# EAGLE design BLEbee-1_0_0 (EAGLE 6.4)
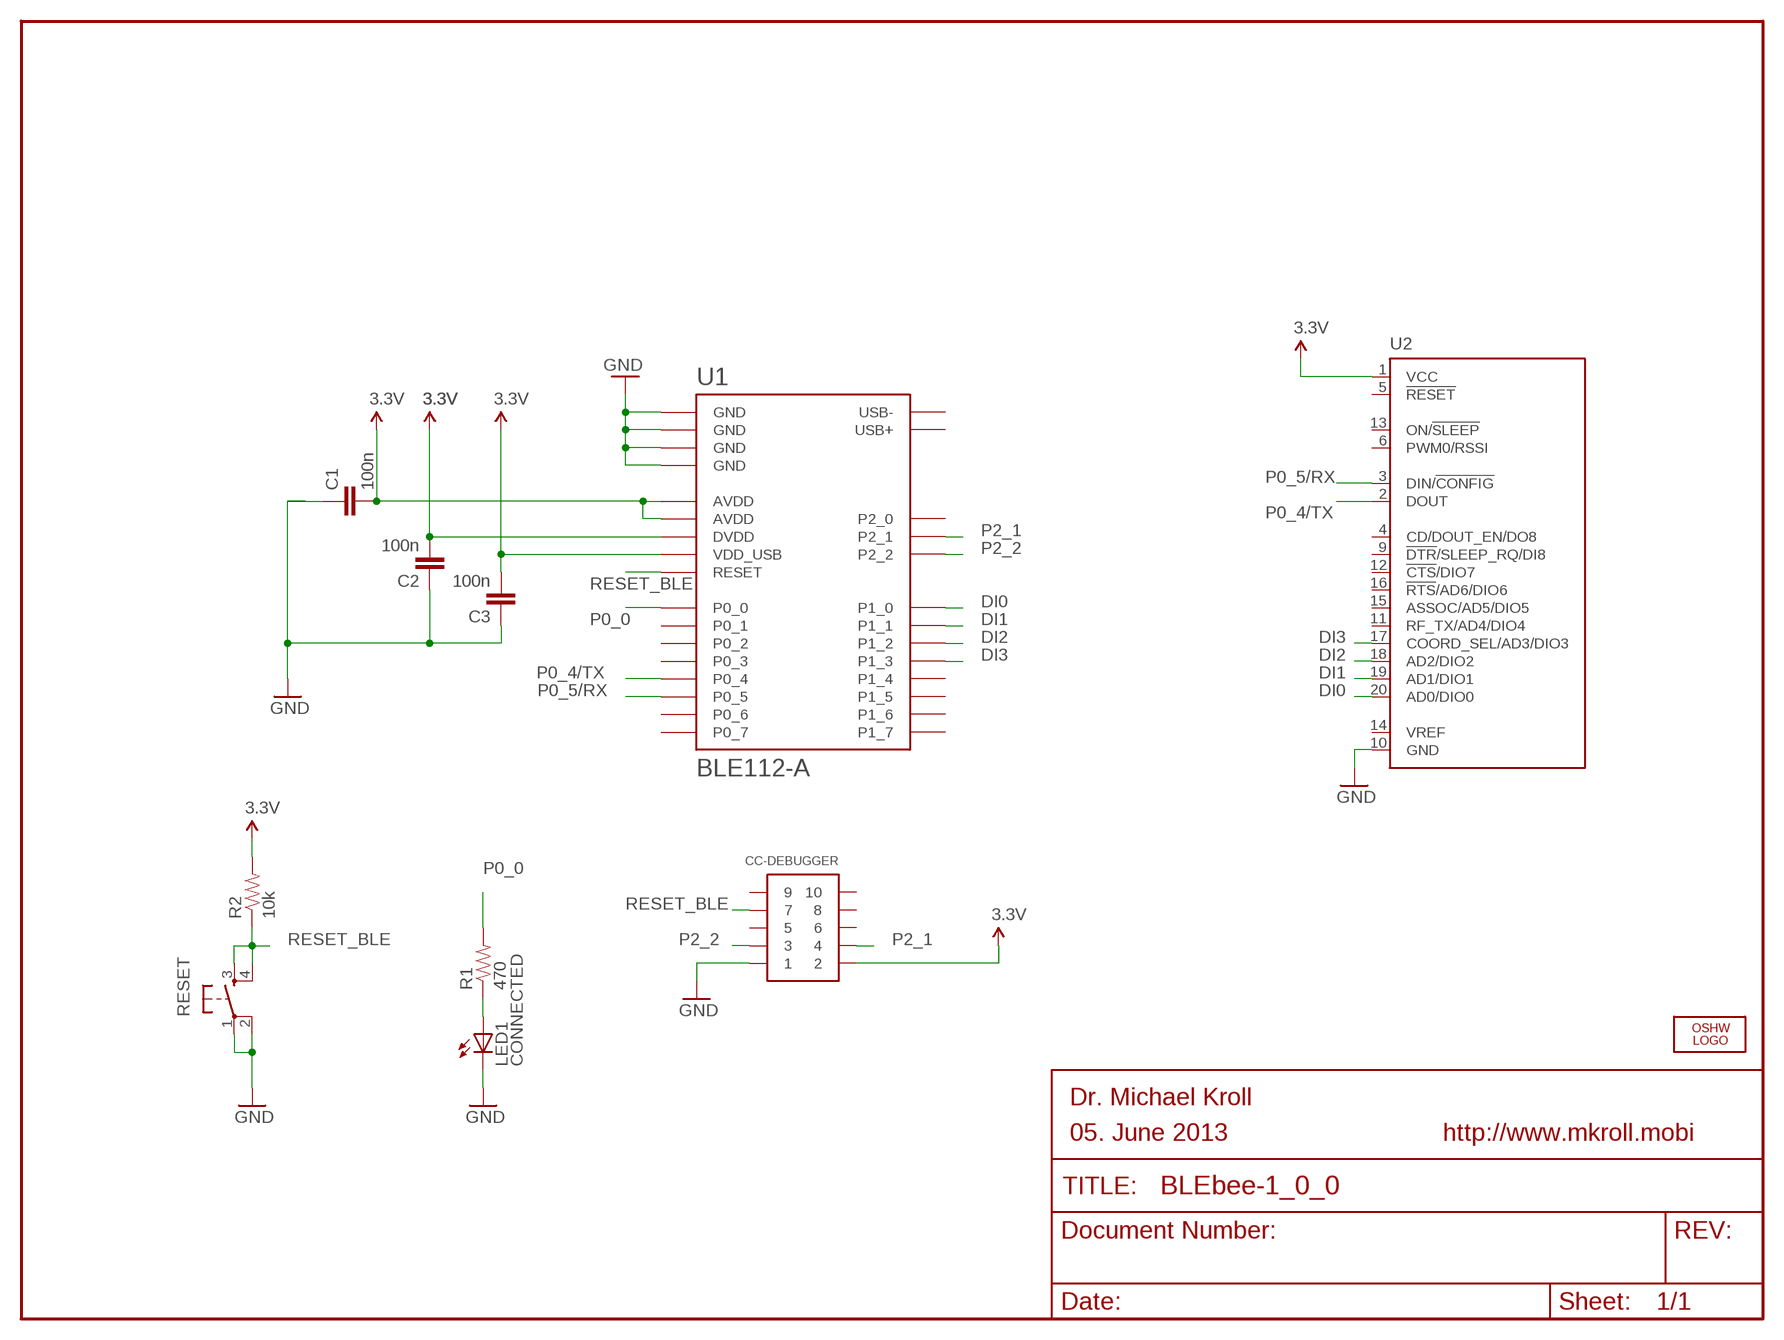
[diagram p0: schematic, sheet 1]

## Parts
C1  100n  CAP0402-CAP  [0402-CAP]
C2  100n  CAP0402-CAP  [0402-CAP]
C3  100n  CAP0402-CAP  [0402-CAP]
CC-DEBUGGER  CONN_5-2-FTSH-V  [FTSH-105-DV]
LED1  CONNECTED  LED0603  [LED-0603]
LOGO1  LOGO-OSHW-6MILX0100-NT  [OSHW_6X100_NOTEXT]
R1  470  RESISTOR0402-RES  [0402-RES]
R2  10k  RESISTOR0402-RES  [0402-RES]
RESET  TAC_SWITCHSMD  [TACTILE_SWITCH_SMD]
U1  BLE112-A  [BLE112-A]
U2  BEE-XBEE-DIP  [20P-DIP-2.0-W/-SILK]

## Nets
3.3V: C1.2 C2.2 C3.2 CC-DEBUGGER.2 R2.2 U1.AVDD1(AVDD) U1.AVDD2(AVDD) U1.DVDD U1.VDD_USB U2.1(VCC)
DI0: U1.P1_0 U2.20(AD0/DIO0)
DI1: U1.P1_1 U2.19(AD1/DIO1)
DI2: U1.P1_2 U2.18(AD2/DIO2)
DI3: U1.P1_3 U2.17(COORD_SEL/AD3/DIO3)
GND: C1.1 C2.1 C3.1 CC-DEBUGGER.1 LED1.C RESET.1 RESET.2 U1.GND1(GND) U1.GND2(GND) U1.GND3(GND) U1.GND4(GND) U2.10(GND)
N$1: LED1.A R1.1
P0_0: R1.2 U1.P0_0
P0_4/TX: U1.P0_4 U2.2(DOUT)
P0_5/RX: U1.P0_5 U2.3(DIN/!CONFIG)
P2_1: CC-DEBUGGER.4 U1.P2_1
P2_2: CC-DEBUGGER.3 U1.P2_2
RESET_BLE: CC-DEBUGGER.7 R2.1 RESET.3 RESET.4 U1.RESET
Unconnected: CC-DEBUGGER.5 CC-DEBUGGER.6 CC-DEBUGGER.8 CC-DEBUGGER.9 CC-DEBUGGER.10 U1.P0_1 U1.P0_2 U1.P0_3 U1.P0_6 U1.P0_7 U1.P1_4 U1.P1_5 U1.P1_6 U1.P1_7 U1.P2_0 U1.USB+ U1.USB- U2.4(CD/DOUT_EN/DO8) U2.5(!RESET) U2.6(PWM0/RSSI) U2.9(!DTR!/SLEEP_RQ/DI8) U2.11(RF_TX/AD4/DIO4) U2.12(!CTS!/DIO7) U2.13(ON/!SLEEP) U2.14(VREF) U2.15(ASSOC/AD5/DIO5) U2.16(!RTS!/AD6/DIO6)

## Notes on the sheet
- Dr. Michael Kroll
- 05. June 2013 | http://www.mkroll.mobi

## Library data of the parts
C1-C3 = SparkFun-Capacitors:CAP: Capacitor Standard 0603 ceramic capacitor, and 0.1" leaded capacitor.
CC-DEBUGGER = pel_misc:CONN_5-2
LED1 = SparkFun-LED:LED: LEDs Standard schematic elements and footprints for 5mm, 3mm, 1206, and 0603 sized LEDs. 5mm - Spark Fun Electronics SKU : COM-00529 (and others)
LOGO1 = Logo:LOGO-OSHW-6MIL
R1 R2 = SparkFun-Resistors:RESISTOR: Resistor Basic schematic elements and footprints for 0603, 1206, and PTH resistors.
RESET = SparkFun-Electromechanical:TAC_SWITCH: Momentary Switch Button commonly used for reset or general input. Spark Fun Electronics SKU : COM-00097 SMT- SWCH-08247; PROD_ID: SWCH-08247
U1 = sf-bluegiga:BLE112-A: Bluetooth Low Energy single-mode module - Bluetooth 4.0, chip antenna
U2 = Module:BEE-XBEE: XBee (TM) /XBee-PRO(TM) OEM RF Modules Source: MaxStream, Inc. xbee_productmanual.pdf

## Board
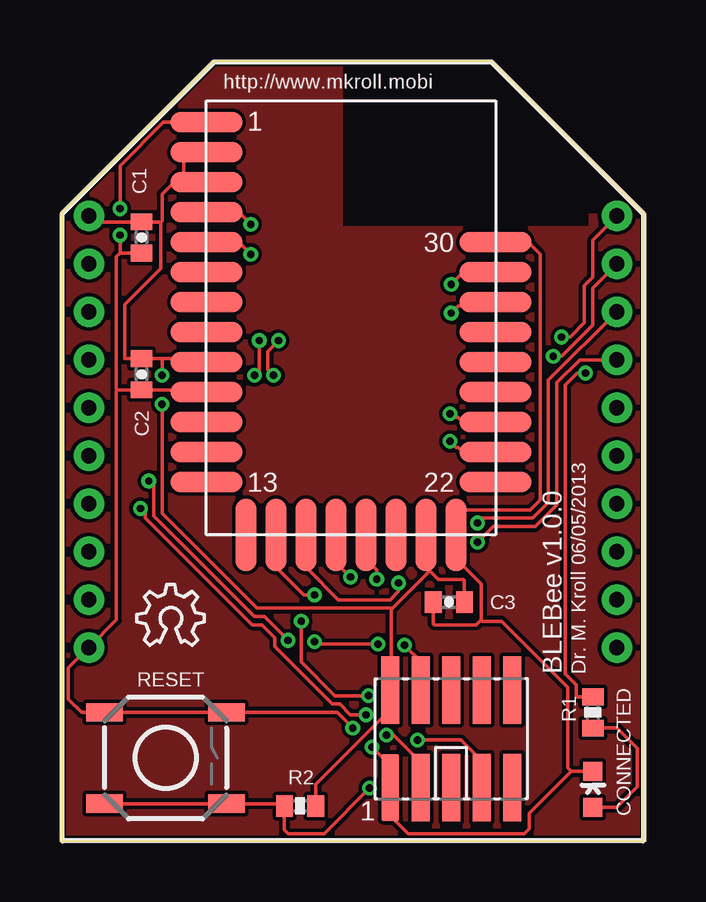
[diagram p1: board, top side]
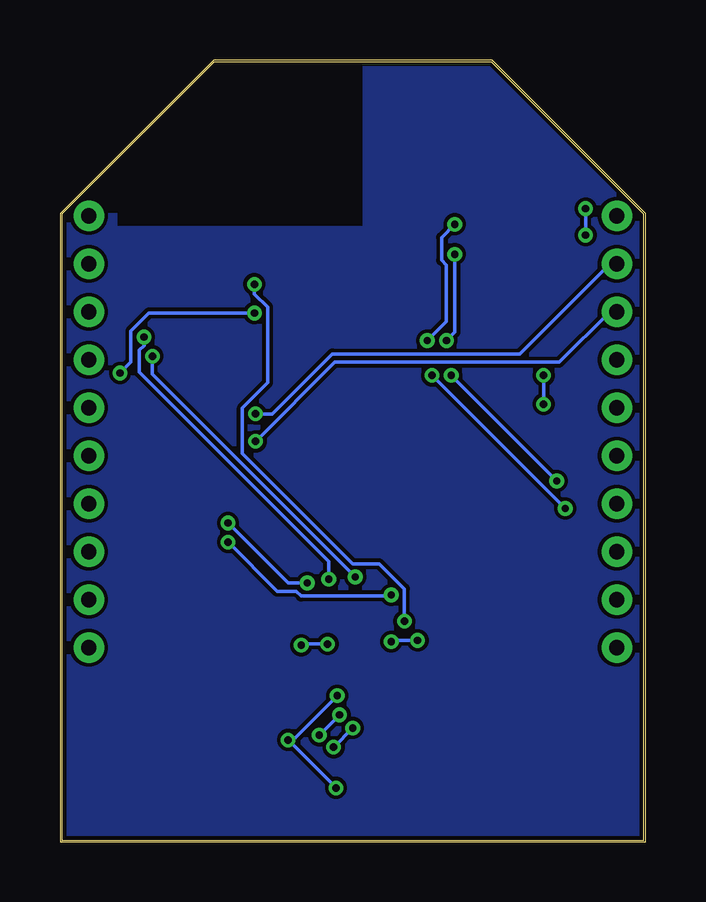
[diagram p2: board, bottom side, seen from below]

Size 24.4 x 32.6 mm. Coordinates in mm from the lower left corner, seen from the top.
Outline: 0,26.2 6.4,32.6 18,32.6 24.4,26.2 24.4,0 0,0 0,26.2
Copper layers (1*2*15*16): Top 0.035mm / dielectric 0.2mm / layer 2 0.0175mm / dielectric 1.1mm / layer 15 0.0175mm / dielectric 0.2mm / Bottom 0.035mm
Design rules "SeeedStudio_DRU_no_angle_20130527": minimum track width 6mil, minimum drill 12mil, track to track 6mil, track to pad 6mil, pad to pad 6mil, via to via 6mil, smd to smd 0mil, copper to edge 10mil, drill to drill 10mil, minimum pad ring 6mil, minimum via ring 6mil, stop-mask expansion 2mil, vias tented up to drill 25mil, thermal gap 10mil
tRestrict: area 11.8,25.7 to 22,32.6
bRestrict: area 11.8,25.7 to 22,32.6

### Footprints (pad centres in the part's own frame; a part is rotated, then mirrored left to right if it is on the bottom)
0402-CAP = smd 0.7 x 0.9: 1 -0.65,0; 2 0.65,0
FTSH-105-DV = smd 0.74 x 2.8: 1 -2.54,-2.03; 2 -2.54,2.03; 3 -1.27,-2.03; 4 -1.27,2.03; 5 0,-2.03; 6 0,2.03; 7 1.27,-2.03; 8 1.27,2.03; 9 2.54,-2.03; 10 2.54,2.03
LED-0603 = smd 0.8 x 0.8: A 0,-0.75; C 0,0.75
0402-RES = smd 0.7 x 0.9: 1 -0.65,0; 2 0.65,0
TACTILE_SWITCH_SMD = smd 1.524 x 0.762: 1 -2.54,1.905; 2 2.54,1.905; 3 -2.54,-1.905; 4 2.54,-1.905
BLE112-A = smd 3 x 0.85: AVDD1 -6.05,6.9; AVDD2 -6.05,5.65; GND1 -6.05,8.15; GND2 -6.05,-3.1; GND4 6,3.15; P0_0 6,0.65; P0_1 6,-0.6; P0_2 6,-1.85; P0_3 6,-3.1; P0_4 6,-4.35; P0_5 6,-5.6; P0_6 6,-6.85; P1_5 -6.05,-6.85; P1_6 -6.05,-0.6; P1_7 -6.05,0.65; P2_0 -6.05,1.9; P2_1 -6.05,3.15; P2_2 -6.05,4.4; RESET 6,1.9; USB+ -6.05,-4.35; USB- -6.05,-5.6; VDD_USB -6.05,-1.85 | smd 0.85 x 3: DVDD 3.1,-9.05; GND3 4.35,-9.05; P0_7 1.85,-9.05; P1_0 0.6,-9.05; P1_1 -0.65,-9.05; P1_2 -1.9,-9.05; P1_3 -3.15,-9.05; P1_4 -4.4,-9.05
20P-DIP-2.0-W/-SILK = drill 0.635 pad 1.27: 1 -11,9; 2 -11,7; 3 -11,5; 4 -11,3; 5 -11,1; 6 -11,-1; 7 -11,-3; 8 -11,-5; 9 -11,-7; 10 -11,-9; 11 11,-9; 12 11,-7; 13 11,-5; 14 11,-3; 15 11,-1; 16 11,1; 17 11,3; 18 11,5; 19 11,7; 20 11,9

### Placement (x,y rotation side)
C1  3.4,25.2 90 top
C2  3.4,19.5 90 top
C3  16.2,10 0 top
CC-DEBUGGER  16.3,4.3 0 top
LED1  22.2,2.2 0 top
LOGO1  3.2,8.2 0 top
R1  22.2,5.4 90 top
R2  10,1.5 0 top
RESET  4.4,3.5 0 top
U1  12.15,21.85 0 top
U2  12.2,17.1 0 top

### Tracks (layer width: path | path; a pad name or v marks a point on that pad's centre or on a via)
3.3V  (via drill 0.3)
  Top 0.152: C3.2 16.85,10.9 16.8,10.95 15.75,10.95 15.4,11.3 | 15.4,11.3 15.3,11.4 15.3,11.75 15.25,11.8 U1.DVDD | R2.2 10.65,2.4 13.55,5.3 13.7,5.3 13.75,5.35 13.75,6.3 CC-DEBUGGER.2 13.75,6.4 13.75,7.3 13.8,7.35 13.8,9.7 | 13.8,9.7 15.4,11.3 | 4.25,20.15 4.95,20.15 5.1,20 U1.VDD_USB | 4.25,20.15 C2.2 2.7,20.15 2.7,22.4 4.2,23.9 4.2,25.85 | U2.1 1.45,25.85 C1.2 4.2,25.85 | 4.2,25.85 4.25,25.9 4.25,27 4.7,27.45 5.05,27.45 5.1,27.5 U1.AVDD2 5.15,27.55 5.15,28.7 5.2,28.75 U1.AVDD1 | v4.25,18.25 4.25,13.7 8.2,9.75 13.75,9.75 13.8,9.7 | 4.25,20.15 v4.25,19.45
  Bottom 0.152: v4.25,19.45 v4.25,18.25
DI0  (via drill 0.3)
  Top 0.152: U2.20 22.2,25.1 22.2,23.55 21.85,23.2 21.85,21.65 21.25,21.05 v20.9,21.05 | v13.2,10.95 13.2,11.35 12.75,11.8 U1.P1_0
  Bottom 0.152: v20.9,21.05 20.9,20.7 21.1,20.5 21.1,19.6 13.2,11.7 v13.2,10.95
DI1  (via drill 0.3)
  Top 0.152: U2.19 22.2,23.1 22.2,21.55 20.9,20.25 v20.55,20.25 | v12.1,11.05 11.55,11.6 11.55,11.75 11.5,11.8 U1.P1_1
  Bottom 0.152: v20.55,20.25 20.55,19.5 v12.1,11.05
DI2  (via drill 0.3)
  Top 0.152: U2.18 20.35,19.25 20.35,14.15 19.7,13.5 17.6,13.5 v17.4,13.3 | v14.1,10.8 14.1,10.45 13.75,10.1 11.6,10.1 10.3,11.4 10.3,11.75 10.25,11.8 U1.P1_2
  Bottom 0.152: v17.4,13.3 14.9,10.8 v14.1,10.8
DI3  (via drill 0.3)
  Top 0.152: U2.17 21.65,20.1 20.7,19.15 20.7,14.05 19.8,13.15 18.05,13.15 v17.4,12.5 | v10.6,10.3 10.15,10.3 9.05,11.4 9.05,11.75 9,11.8 U1.P1_3
  Bottom 0.152: v17.4,12.5 15.35,10.45 14.55,10.45 14.35,10.25 10.65,10.25 v10.6,10.3
GND  (via drill 0.3)
  Top 0.152: C3.1 15.55,9.1 15.6,9.05 17.35,9.05 17.55,9.25 | 17.55,9.25 17.55,10.75 16.5,11.8 U1.GND3 16.5,13.8 16.55,13.85 19.6,13.85 20,14.25 20,24.5 19.5,25 U1.GND4 | U1.GND2 5.1,18.75 5,18.85 C2.1 2.4,18.85 | 2.5,24.55 C1.1 | 2.5,24.55 2.35,24.4 2.35,18.9 2.4,18.85 | U1.GND1 4.3,30 2.5,28.2 v2.5,26.4 | 2.5,24.55 v2.5,25.3 | 21.3,2.95 LED1.C | 21.3,2.95 19.55,1.2 19.55,0.55 19.35,0.35 14.5,0.35 13.8,1.05 13.8,1.25 13.75,1.3 13.75,2.25 CC-DEBUGGER.1 13.75,2.3 13.75,3.2 v13,3.95 | v12.2,4.75 11.55,5.4 7,5.4 RESET.2 6.9,5.4 1.9,5.4 RESET.1 0.9,5.4 0.35,5.95 0.35,7.25 U2.10 2.35,9.25 2.35,18.8 2.4,18.85 | 21.3,2.95 21.15,3.1 21.15,6.45 18.4,9.2 17.6,9.2 17.55,9.25
  Bottom 0.152: v2.5,25.3 v2.5,26.4 | v13,3.95 v12.2,4.75
N$1
  Top 0.152: LED1.A 23.2,1.45 24.05,2.3 24.05,3.9 23.2,4.75 R1.1
N$2
  pour Top: 0.1,26.3 6.4,32.6 12,32.6 12,26.1 24.4,26.1 24.4,0.1 24.3,0 0.1,0
N$3
  pour Bottom: 0.1,0 0.1,26.3 6.4,32.6 11.9,32.6 11.9,26.1 24.4,26.1 24.4,0
P0_0  (via drill 0.3)
  Top 0.152: R1.2 21.5,6.05 21.5,6.55 21.05,7 21.05,19.05 21.55,19.55 v21.9,19.55 | v16.3,22.05 16.6,22.35 16.65,22.35 16.75,22.45 17.1,22.45 17.15,22.5 U1.P0_0
  Bottom 0.152: v21.9,19.55 21.45,20 21.45,21.3 20.7,22.05 v16.3,22.05
P0_4/TX  (via drill 0.3)
  Top 0.152: v16.25,17.85 16.35,17.85 16.5,17.7 16.6,17.7 16.75,17.55 17.1,17.55 17.15,17.5 U1.P0_4
  Bottom 0.152: U2.2 1.5,24.1 5.25,20.35 13.05,20.35 15.55,17.85 v16.25,17.85
P0_5/RX  (via drill 0.3)
  Top 0.152: v16.25,16.7 16.5,16.45 16.6,16.45 16.75,16.3 17.1,16.3 17.15,16.25 U1.P0_5
  Bottom 0.152: U2.3 1.5,22.1 3.6,20 12.95,20 v16.25,16.7
P2_1  (via drill 0.3)
  Top 0.152: v14.35,8.2 15.05,7.5 15.05,6.35 CC-DEBUGGER.4 | v13.25,8.25 10.7,8.25 v10.6,8.35 | v9.5,8.4 8.5,9.4 8.1,9.4 3.9,13.6 3.9,14.85 v3.7,15.05 | v8.1,19.45 8.3,19.65 v8.3,20.9 | v7.95,24.5 7.5,24.95 7.15,24.95 7.1,25 U1.P2_1
  Bottom 0.152: v14.35,8.2 14.3,8.25 v13.25,8.25 | v10.6,8.35 10.55,8.4 v9.5,8.4 | v8.1,19.45 v3.7,15.05 | v8.3,20.9 7.95,21.25 v7.95,24.5
P2_2  (via drill 0.3)
  Top 0.152: v13.6,4.45 13.9,4.45 15.05,3.3 15.05,2.3 CC-DEBUGGER.3 | v12.75,5.3 12.1,5.3 11.65,5.75 11.35,5.75 8.95,8.15 8.95,8.5 8.4,9.05 8,9.05 3.55,13.5 3.55,13.7 v3.35,13.9 | v8.9,19.45 8.65,19.7 8.65,20.45 v9.1,20.9 | v7.95,25.75 7.5,26.2 7.15,26.2 7.1,26.25 U1.P2_2
  Bottom 0.152: v12.75,5.3 v13.6,4.45 | v8.9,19.45 v3.35,13.9 | v9.1,20.9 8.3,21.7 8.3,24.05 8.5,24.25 8.5,25.2 v7.95,25.75
RESET_BLE  (via drill 0.3)
  Top 0.152: RESET.3 1.9,1.6 6.9,1.6 RESET.4 9.35,1.6 R2.1 9.35,0.5 9.5,0.35 11,0.35 v12.9,2.25 | v14.9,4.25 16.7,4.25 17.55,3.4 17.55,2.3 CC-DEBUGGER.7 | U1.RESET 16.8,23.75 v16.3,23.25 | v10.05,9.2 10.05,7.5 11.45,6.1 v12.85,6.1
  Bottom 0.152: v12.9,2.25 v14.9,4.25 14.75,4.2 v12.85,6.1 | v16.3,23.25 16.3,22.85 15.75,22.3 15.75,19.15 16.8,18.1 16.8,16.2 12.2,11.6 11.1,11.6 10.05,10.55 v10.05,9.2

### Text on the board
tNames: http://www.mkroll.mobi | BLEBee v1.0.0 | Dr. M. Kroll 06/05/2013 | 1